# EAGLE design suit (EAGLE 6.5.0)
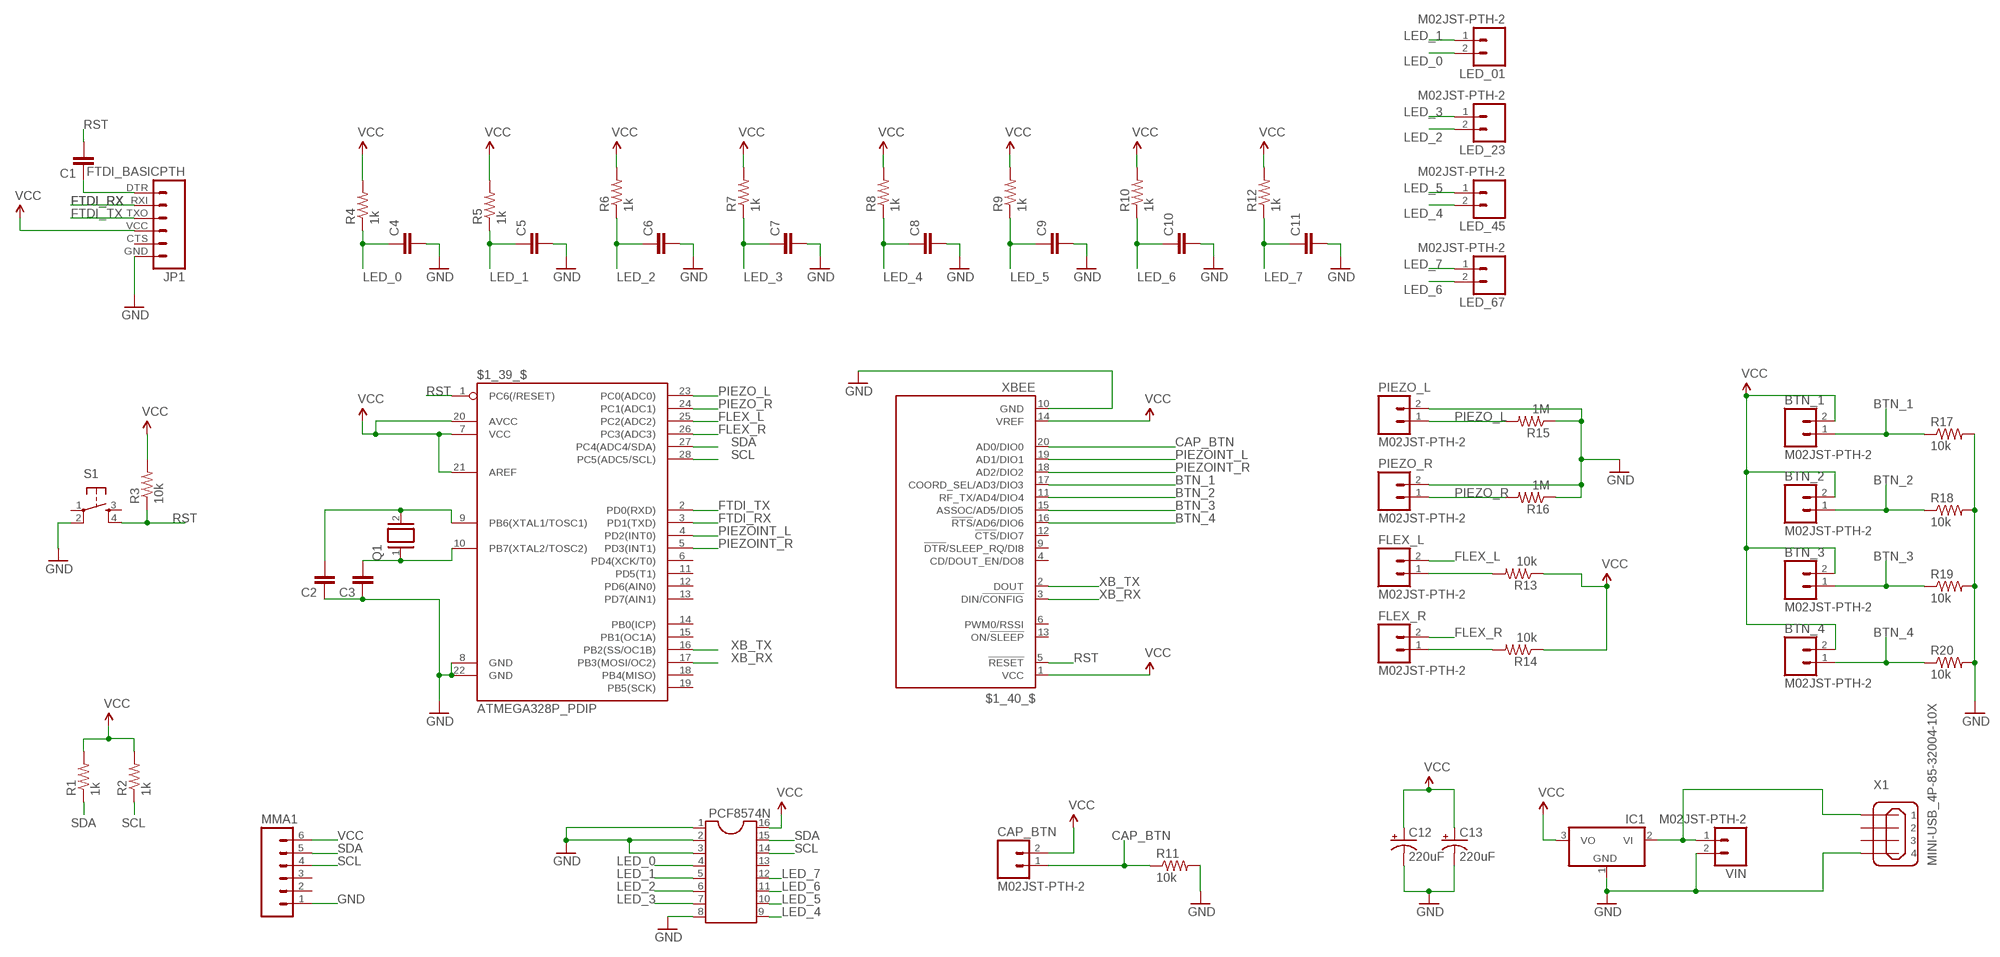
[diagram p0: schematic, sheet 1]

## Parts
$1_39_$  ATMEGA328P_PDIP  [DIL28-3]
$1_40_$  XBEE  [XBEE]
BTN_1  M02JST-PTH-2  [JST-2-PTH]
BTN_2  M02JST-PTH-2  [JST-2-PTH]
BTN_3  M02JST-PTH-2  [JST-2-PTH]
BTN_4  M02JST-PTH-2  [JST-2-PTH]
C1  CAPEZ  [CAP-PTH-SMALLEZ]
C2  CAPEZ  [CAP-PTH-SMALLEZ]
C3  CAPEZ  [CAP-PTH-SMALLEZ]
C4  CAPEZ  [CAP-PTH-SMALLEZ]
C5  CAPEZ  [CAP-PTH-SMALLEZ]
C6  CAPEZ  [CAP-PTH-SMALLEZ]
C7  CAPEZ  [CAP-PTH-SMALLEZ]
C8  CAPEZ  [CAP-PTH-SMALLEZ]
C9  CAPEZ  [CAP-PTH-SMALLEZ]
C10  CAPEZ  [CAP-PTH-SMALLEZ]
C11  CAPEZ  [CAP-PTH-SMALLEZ]
C12  220uF  CPOL-USB45181A  [B45181A]
C13  220uF  CPOL-USB45181A  [B45181A]
CAP_BTN  M02JST-PTH-2  [JST-2-PTH]
FLEX_L  M02JST-PTH-2  [JST-2-PTH]
FLEX_R  M02JST-PTH-2  [JST-2-PTH]
IC1  79L05Z  [TO92]
JP1  FTDI_BASICPTH  [FTDI_BASIC]
LED_01  M02JST-PTH-2  [JST-2-PTH]
LED_23  M02JST-PTH-2  [JST-2-PTH]
LED_45  M02JST-PTH-2  [JST-2-PTH]
LED_67  M02JST-PTH-2  [JST-2-PTH]
MMA1  M06FEMALE_LOCK  [1X06_FEMALE_LOCK.010]
PCF8574N  DIL16S  [SOCKET-16]
PIEZO_L  M02JST-PTH-2  [JST-2-PTH]
PIEZO_R  M02JST-PTH-2  [JST-2-PTH]
Q1  XTAL/S  [QS]
R1  1k  R-US_0207/10  [0207/10]
R2  1k  R-US_0207/10  [0207/10]
R3  10k  R-US_0207/10  [0207/10]
R4  1k  R-US_0207/10  [0207/10]
R5  1k  R-US_0207/10  [0207/10]
R6  1k  R-US_0207/10  [0207/10]
R7  1k  R-US_0207/10  [0207/10]
R8  1k  R-US_0207/10  [0207/10]
R9  1k  R-US_0207/10  [0207/10]
R10  1k  R-US_0207/10  [0207/10]
R11  10k  R-US_0207/10  [0207/10]
R12  1k  R-US_0207/10  [0207/10]
R13  10k  R-US_0207/10  [0207/10]
R14  10k  R-US_0207/10  [0207/10]
R15  1M  R-US_0207/10  [0207/10]
R16  1M  R-US_0207/10  [0207/10]
R17  10k  R-US_0207/10  [0207/10]
R18  10k  R-US_0207/10  [0207/10]
R19  10k  R-US_0207/10  [0207/10]
R20  10k  R-US_0207/10  [0207/10]
S1  TAC_SWITCHPTH  [TACTILE-PTH]
VIN  M02JST-PTH-2  [JST-2-PTH]
X1  MINI-USB_4P-85-32004-10X  [85-32004-10X]

## Nets
BTN_1: $1_40_$.17(COORD_SEL/AD3/DIO3) BTN_1.1 R17.1
BTN_2: $1_40_$.11(RF_TX/AD4/DIO4) BTN_2.1 R18.1
BTN_3: $1_40_$.15(ASSOC/AD5/DIO5) BTN_3.1 R19.1
BTN_4: $1_40_$.16(!RTS!/AD6/DIO6) BTN_4.1 R20.1
CAP_BTN: $1_40_$.20(AD0/DIO0) CAP_BTN.1 R11.1
FLEX_L: $1_39_$.25(PC2(ADC2)) FLEX_L.2
FLEX_R: $1_39_$.26(PC3(ADC3)) FLEX_R.2
FTDI_RX: $1_39_$.3(PD1(TXD)) JP1.RXI
FTDI_TX: $1_39_$.2(PD0(RXD)) JP1.TXO
GND: $1_39_$.8(GND) $1_39_$.22(GND) $1_40_$.10(GND) C2.1 C3.1 C4.2 C5.2 C6.2 C7.2 C8.2 C9.2 C10.2 C11.2 C12.- C13.- IC1.1(GND) JP1.GND MMA1.1 PCF8574N.1 PCF8574N.2 PCF8574N.3 PCF8574N.8 PIEZO_L.2 PIEZO_R.2 R11.2 R15.1 R16.1 R17.2 R18.2 R19.2 R20.2 S1.2 VIN.2 X1.4
LED_0: C4.1 LED_01.2 PCF8574N.4 R4.1
LED_1: C5.1 LED_01.1 PCF8574N.5 R5.1
LED_2: C6.1 LED_23.2 PCF8574N.6 R6.1
LED_3: C7.1 LED_23.1 PCF8574N.7 R7.1
LED_4: C8.1 LED_45.2 PCF8574N.9 R8.1
LED_5: C9.1 LED_45.1 PCF8574N.10 R9.1
LED_6: C10.1 LED_67.2 PCF8574N.11 R10.1
LED_7: C11.1 LED_67.1 PCF8574N.12 R12.1
N$1: FLEX_L.1 R13.2
N$2: FLEX_R.1 R14.2
N$4: C1.1 JP1.DTR
N$5: $1_39_$.10(PB7(XTAL2/TOSC2)) C3.2 Q1.1
N$6: $1_39_$.9(PB6(XTAL1/TOSC1)) C2.2 Q1.2
N$10: IC1.2(VI) VIN.1 X1.1
PIEZO_L: $1_39_$.23(PC0(ADC0)) PIEZO_L.1 R15.2
PIEZO_R: $1_39_$.24(PC1(ADC1)) PIEZO_R.1 R16.2
PIEZOINT_L: $1_39_$.4(PD2(INT0)) $1_40_$.19(AD1/DIO1)
PIEZOINT_R: $1_39_$.5(PD3(INT1)) $1_40_$.18(AD2/DIO2)
RST: $1_39_$.1(PC6(/RESET)) $1_40_$.5(!RESET) C1.2 R3.1 S1.4
SCL: $1_39_$.28(PC5(ADC5/SCL)) MMA1.4 PCF8574N.14 R2.1
SDA: $1_39_$.27(PC4(ADC4/SDA)) MMA1.5 PCF8574N.15 R1.1
VCC: $1_39_$.7(VCC) $1_39_$.20(AVCC) $1_39_$.21(AREF) $1_40_$.1(VCC) $1_40_$.14(VREF) BTN_1.2 BTN_2.2 BTN_3.2 BTN_4.2 C12.+ C13.+ CAP_BTN.2 IC1.3(VO) JP1.VCC MMA1.6 PCF8574N.16 R1.2 R2.2 R3.2 R4.2 R5.2 R6.2 R7.2 R8.2 R9.2 R10.2 R12.2 R13.1 R14.1
XB_RX: $1_39_$.17(PB3(MOSI/OC2)) $1_40_$.3(DIN/!CONFIG)
XB_TX: $1_39_$.16(PB2(SS/OC1B)) $1_40_$.2(DOUT)
Unconnected: $1_39_$.6(PD4(XCK/T0)) $1_39_$.11(PD5(T1)) $1_39_$.12(PD6(AIN0)) $1_39_$.13(PD7(AIN1)) $1_39_$.14(PB0(ICP)) $1_39_$.15(PB1(OC1A)) $1_39_$.18(PB4(MISO)) $1_39_$.19(PB5(SCK)) $1_40_$.4(CD/DOUT_EN/DO8) $1_40_$.6(PWM0/RSSI) $1_40_$.9(!DTR!/SLEEP_RQ/DI8) $1_40_$.12(!CTS!/DIO7) $1_40_$.13(ON/!SLEEP) JP1.CTS MMA1.2 MMA1.3 PCF8574N.13 S1.1 S1.3 X1.2 X1.3

## Library data of the parts
$1_39_$ = SparkFun-DigitalIC:ATMEGA328P_PDIP: uC used in the Arduino 32kb flash, 1k EEPROM, 2k SRAM This is the through-hole version of this chip.
$1_40_$ = maxstream:XBEE: XBee (TM) /XBee-PRO(TM) OEM RF Modules Source: MaxStream, Inc. xbee_productmanual.pdf; MPN: XBP24-Z7UIT-004; OC_FARNELL: 1751799; OC_NEWARK: 34R5507
BTN_1-BTN_4 CAP_BTN FLEX_L FLEX_R LED_01 LED_23 LED_45 LED_67 PIEZO_L PIEZO_R VIN = SparkFun-Connectors:M02: Standard 2-pin 0.1" header. Use with - straight break away headers ( PRT-00116) - right angle break away headers (PRT-00553) - swiss pins (PRT-00743) - machine pins (PRT-00117) - female headers (PRT-00115) Molex polarized connector foot print use with: PRT-08233 with associated crimp pins and housings. 2.54_SCREWTERM for use with PRT-10571. 3.5mm Screw Terminal footprints for PRT-08084 5mm Screw Terminal footprints for use with PRT-08433
C1-C11 = SparkFun-Passives:CAP: Capacitor Standard 0603 ceramic capacitor, and 0.1" leaded capacitor.
C12 C13 = rcl:CPOL-US: POLARIZED CAPACITOR, American symbol
IC1 = linear:79*: Negative VOLTAGE REGULATOR
JP1 = SparkFun-Connectors:FTDI_BASIC: FTDI Basic header with labels
MMA1 = SparkFun-Connectors:M06: Header 6 Standard 6-pin 0.1" header. Use with straight break away headers (SKU : PRT-00116), right angle break away headers (PRT-00553), swiss pins (PRT-00743), machine pins (PRT-00117), and female headers (PRT-00115). Molex polarized connector foot print use with SKU : PRT-08094 with associated crimp pins and housings. NOTES ON THE VARIANTS LOCK and LOCK_LONGPADS... This footprint was designed to help hold the alignment of a through-hole component (i.e. 6-pin header) while soldering it into place. You may notice that each hole has been shifted either up or down by 0.005 of an inch from it's more standard position (which is a perfectly straight line). This slight alteration caused the pins (the squares in the middle) to touch the edges of the holes. Because they are alternating, it causes a "brace" to hold the component in place. 0.005 has proven to be the perfect amount of "off-center" position when using our standard breakaway headers. Although looks a little odd when you look at the bare footprint, once you have a header in there, the alteration is very hard to notice. Also,if you push a header all the way into place, it is covered up entirely on the bottom side. This idea of altering the position of holes to aid alignment will be further integrated into the Sparkfun Library for other footprints. It can help hold any component with 3 or more connection pins.
PCF8574N = ic-package:DIL16: Dual In Line / Socket
Q1 = special:XTAL/S: CRYSTAL
R1-R20 = resistor:R-US_: RESISTOR, American symbol
S1 = SparkFun-Electromechanical:TAC_SWITCH: Momentary Switch Button commonly used for reset or general input. Spark Fun Electronics SKU : COM-00097 SMT- SWCH-08247
X1 = con-cypressindustries:MINI-USB_4P-: MINI USB 4 Pol. Source: www.cypressindustries.com; OC_FARNELL: unknown; OC_NEWARK: unknown

## Board
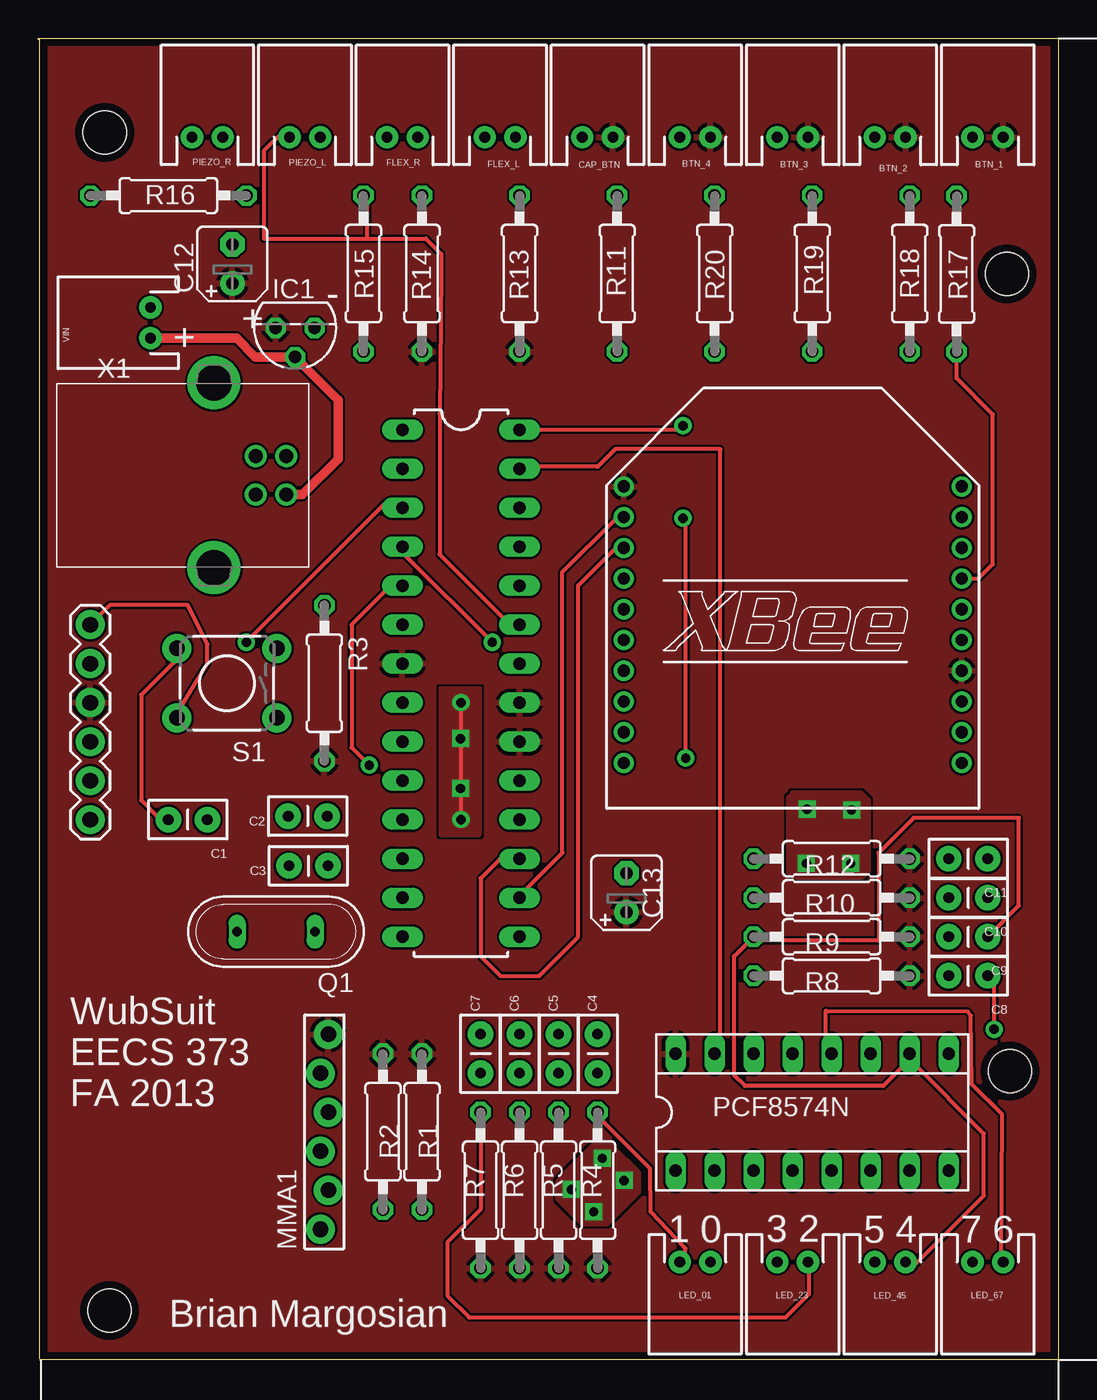
[diagram p1: board, top side]
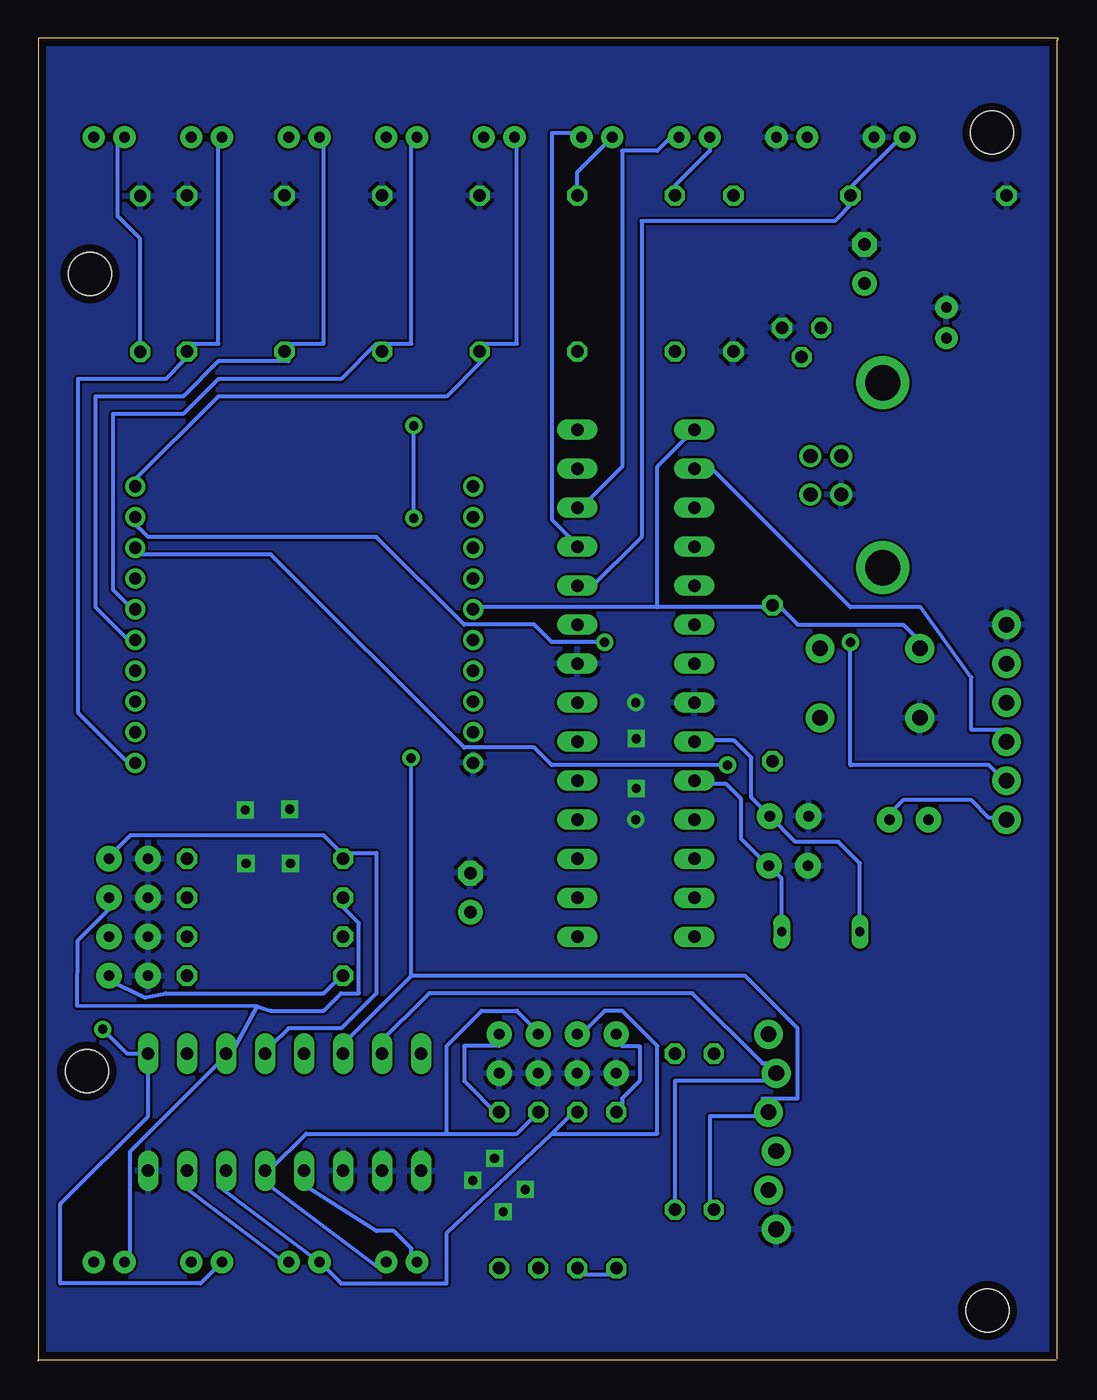
[diagram p2: board, bottom side, seen from below]

Size 66.4 x 86.13 mm. Coordinates in mm from the lower left corner, seen from the top.
Outline: 0.08,0.15 0.08,86.06 0,86.06 0,86.13 66.4,86.13 66.4,0.08
Outline: 66.4,0 66.4,0.08
Outline: 66.4,0.08 0.15,0.08
Copper layers (1+16): Top 0.0178mm / dielectric 12mil / Bottom 0.0178mm
Design rules "AVC-2Lyr": minimum track width 6mil, minimum drill 8mil, track to track 6mil, track to pad 6mil, pad to pad 6mil, via to via 6mil, smd to smd 6mil, copper to edge 20mil, drill to drill 16mil, minimum pad ring 10mil, minimum via ring 10mil, stop-mask expansion 3mil, vias tented up to drill 0mil, thermal gap 10mil
Holes 2.8 mm at 4.62,3.3 4.32,80.01 63.04,70.79 63.25,18.87

### Footprints (pad centres in the part's own frame; a part is rotated, then mirrored left to right if it is on the bottom)
DIL28-3 = drill 0.813 long: 1 -16.51,-3.81; 2 -13.97,-3.81; 3 -11.43,-3.81; 4 -8.89,-3.81; 5 -6.35,-3.81; 6 -3.81,-3.81; 7 -1.27,-3.81; 8 1.27,-3.81; 9 3.81,-3.81; 10 6.35,-3.81; 11 8.89,-3.81; 12 11.43,-3.81; 13 13.97,-3.81; 14 16.51,-3.81; 15 16.51,3.81; 16 13.97,3.81; 17 11.43,3.81; 18 8.89,3.81; 19 6.35,3.81; 20 3.81,3.81; 21 1.27,3.81; 22 -1.27,3.81; 23 -3.81,3.81; 24 -6.35,3.81; 25 -8.89,3.81; 26 -11.43,3.81; 27 -13.97,3.81; 28 -16.51,3.81
XBEE = drill 0.8 pad 1.27: 1 -11,9; 2 -11,7; 3 -11,5; 4 -11,3; 5 -11,1; 6 -11,-1; 7 -11,-3; 8 -11,-5; 9 -11,-7; 10 -11,-9; 11 11,-9; 12 11,-7; 13 11,-5; 14 11,-3; 15 11,-1; 16 11,1; 17 11,3; 18 11,5; 19 11,7; 20 11,9
JST-2-PTH = drill 0.7 pad 1.448: 1 -1,0; 2 1,0
CAP-PTH-SMALLEZ = drill 0.7 pad 1.651: 1 0,0; 2 2.54,0
B45181A = drill 0.813 pad 1.6: + -1.27,0 | drill 0.813 pad 1.6 octagon: - 1.27,0
TO92 = drill 0.813 octagon: 1 -1.27,0; 2 0,1.905; 3 1.27,0
FTDI_BASIC = drill 1.016 pad 1.88: CTS 10.16,0; DTR 0,0; GND 12.7,0; RXI 2.54,0; TXO 5.08,0; VCC 7.62,0
1X06_FEMALE_LOCK.010 = drill 1.016 pad 1.88: 1 0,0.254; 2 2.54,-0.254; 3 5.08,0.254; 4 7.62,-0.254; 5 10.16,0.254; 6 12.7,-0.254
SOCKET-16 = drill 0.813 long: 1 -8.89,-3.81; 2 -6.35,-3.81; 3 -3.81,-3.81; 4 -1.27,-3.81; 5 1.27,-3.81; 6 3.81,-3.81; 7 6.35,-3.81; 8 8.89,-3.81; 9 8.89,3.81; 10 6.35,3.81; 11 3.81,3.81; 12 1.27,3.81; 13 -1.27,3.81; 14 -3.81,3.81; 15 -6.35,3.81; 16 -8.89,3.81
QS = drill 0.61 long: 1 -2.54,0; 2 2.54,0
0207/10 = drill 0.813 octagon: 1 -5.08,0; 2 5.08,0
TACTILE-PTH = drill 1.016 pad 1.88: 1 -3.251,2.261; 2 3.251,2.261; 3 -3.251,-2.261; 4 3.251,-2.261
85-32004-10X = drill 0.92 pad 1.27: 1 4.71,-1.25; 2 4.71,1.25; 3 2.71,1.25; 4 2.71,-1.25 | drill 2.3 pad 3: M1 0,6.02; M2 0,-6.02

### Placement (x,y rotation side)
$1_39_$  27.51,44.15 270 top
$1_40_$  49.1,47.96 0 top
BTN_1  61.8,79.71 0 top
BTN_2  55.45,79.71 0 top
BTN_3  49.1,79.71 0 top
BTN_4  42.75,79.71 0 top
C1  11,35.26 180 top
C2  16.26,35.48 0 top
C3  16.31,32.26 0 top
C4  36.4,21.29 270 top
C5  33.86,21.29 270 top
C6  31.32,21.29 270 top
C7  28.78,21.29 270 top
C8  61.8,25.1 180 top
C9  61.8,27.64 180 top
C10  61.8,30.18 180 top
C11  61.8,32.72 180 top
C12  12.62,71.45 90 top
C13  38.28,30.51 90 top
CAP_BTN  36.4,79.71 0 top
FLEX_L  30.05,79.71 0 top
FLEX_R  23.7,79.71 0 top
IC1  16.71,67.28 180 top
JP1  3.38,35.26 90 top
LED_01  42.75,6.45 180 top
LED_23  49.1,6.45 180 top
LED_45  55.45,6.45 180 top
LED_67  61.8,6.45 180 top
MMA1  18.62,8.59 90 top
PCF8574N  50.37,16.21 0 top
PIEZO_L  17.35,79.71 0 top
PIEZO_R  11,79.71 0 top
Q1  15.47,27.97 180 top
R1  24.97,14.94 90 top
R2  22.43,14.94 90 top
R3  18.62,44.15 270 top
R4  36.4,11.13 270 top
R5  33.86,11.13 270 top
R6  31.32,11.13 270 top
R7  28.78,11.13 270 top
R8  51.64,25.1 0 top
R9  51.64,27.64 0 top
R10  51.64,30.18 0 top
R11  37.67,70.82 90 top
R12  51.64,32.72 0 top
R13  31.32,70.82 90 top
R14  24.97,70.82 90 top
R15  21.16,70.82 90 top
R16  8.46,75.9 0 top
R17  59.77,70.79 90 top
R18  56.72,70.82 90 top
R19  50.37,70.82 90 top
R20  44.02,70.82 90 top
S1  12.27,44.15 180 top
VIN  7.29,67.61 90 top
X1  11.43,57.68 0 top

### Tracks (layer width: path | path; a pad name or v marks a point on that pad's centre or on a via)
BTN_1
  Top 0.254: 60.73,79.64 BTN_1.1 | $1_40_$.17 61.19,50.96 62.13,51.89 62.13,61.65 59.77,64.01 R17.1
  Bottom 0.254: 60.4,79.96 BTN_1.1 61.24,79.26 61.24,74.55 59.77,73.08 R17.1
BTN_2
  Bottom 0.254: $1_40_$.11 60.4,38.81 63.83,42.24 63.83,63.96 58.12,63.96 56.97,65.1 R18.1 56.97,66.24 54.69,66.24 54.69,79.96 BTN_2.1
BTN_3
  Bottom 0.254: $1_40_$.15 60.4,46.81 62.69,49.1 62.69,62.81 56.97,62.81 54.69,65.1 50.11,65.1 R19.1 50.11,66.24 47.83,66.24 47.83,79.96 BTN_3.1
BTN_4
  Bottom 0.254: 44.4,66.24 46.69,63.96 54.69,63.96 56.97,61.67 61.54,61.67 61.54,50.24 60.4,49.1 $1_40_$.16 | 44.4,66.24 42.11,66.24 42.11,79.96 BTN_4.1 | 44.4,66.24 R20.1
CAP_BTN
  Bottom 0.254: $1_40_$.20 60.4,57.1 54.69,62.81 39.83,62.81 37.54,65.1 R11.1 37.54,66.24 35.26,66.24 35.26,79.96 CAP_BTN.1
FLEX_L
  Bottom 0.254: $1_39_$.25 31.83,53.67 32.97,54.81 32.97,79.96 30.68,79.96 FLEX_L.2
FLEX_R
  Bottom 0.254: $1_39_$.26 30.68,55.96 28.4,58.24 28.4,78.82 26.11,78.82 24.97,79.96 FLEX_R.2
FTDI_RX  (via drill 0.61)
  Top 0.254: v13.54,46.81 22.68,55.96 $1_39_$.3
  Bottom 0.254: v13.54,46.81 13.54,38.81 4.52,38.81 3.38,37.67 JP1.RXI
FTDI_TX
  Bottom 0.254: $1_39_$.2 22.68,58.24 13.54,49.1 8.97,49.1 5.66,44.53 5.66,41.1 3.38,41.1 JP1.TXO
GND  (via drill 0.6, 0.61)
  Top 0.254: S1.2 9.02,42.16 11,45.42 11,46.69 9.73,49.23 4.65,49.23 JP1.GND | v27.51,42.88 v27.51,35.26
  other vias: 34.7,11.18 36.14,9.73 38.13,11.76 36.7,13.21 52.88,32.41 49.99,32.41 50.04,35.94 52.93,35.89 27.48,40.54 27.48,37.29
  pour Bottom (rank 6): 0.25,85.83 66.14,85.85 66.01,0.15 0.38,0.38
  pour Top: 37.29,14.1 39.07,12.32 39.07,10.95 37.01,8.89 35.43,8.89 33.78,10.54 33.78,11.71 33.96,11.89 33.96,11.96 36.12,14.12
  pour Top: 49.07,37.06 53.52,37.06 54.05,36.53 54.05,31.9 53.62,31.47 49.17,31.47 48.82,31.83 48.82,36.73 49.1,37.01
  pour Top: 26.19,43.84 28.7,43.84 28.73,43.87 28.73,34.29 28.68,34.24 26.21,34.24 26.19,34.26 26.19,43.69
LED_0
  Top 0.254: R4.1 36.4,15.95 39.83,12.52 39.85,9.73 42.11,7.34 42.11,6.2 LED_01.2
  Bottom 0.254: R4.1 36.4,15.95 38.68,18.24 38.68,20.52 36.4,20.52 C4.1 | PCF8574N.4 48.97,11.38 44.4,8.48 43.26,8.48 42.11,7.34 42.11,6.2 LED_01.2
LED_1
  Bottom 0.254: R5.1 35.26,14.81 39.83,14.81 | 39.83,14.81 48.97,14.81 51.26,12.52 PCF8574N.5 51.26,11.38 44.4,6.2 LED_01.1 | 39.83,14.81 39.83,20.52 37.54,22.81 35.26,22.81 34.11,21.67 C5.1
LED_2
  Bottom 0.254: 47.83,6.2 54.69,11.38 PCF8574N.6 | 32.97,14.81 39.8,8.36 39.83,5.05 46.69,5.05 47.83,6.2 | 32.97,14.81 31.83,15.95 R6.1 | 47.83,6.2 LED_23.2 | 32.97,14.81 26.11,14.81 26.11,20.52 28.4,22.81 29.54,22.81 30.68,21.67 C6.1
LED_3
  Top 0.254: R7.1 28.78,9.88 26.62,7.72 26.62,4.27 28.04,2.84 48.64,2.84 50.17,4.37 50.17,6.38 LED_23.1
  Bottom 0.254: PCF8574N.7 56.97,11.38 50.11,6.2 LED_23.1 | R7.1 28.4,15.95 28.4,17.09 27.25,18.24 27.25,20.52 28.4,20.52 C7.1
LED_4  (via drill 0.6)
  Top 0.254: v62.2,21.62 62.2,24.69 C8.1
  Bottom 0.254: LED_45.2 54.69,6.2 55.83,5.05 64.97,5.05 64.97,10.24 59.26,15.95 PCF8574N.9 60.6,20.02 v62.2,21.62 | R8.1 46.69,25.1 47.83,23.95 58.12,23.95 59.46,23.67 61.8,24.79 C8.1
LED_5
  Top 0.254: LED_45.1 56.97,6.2 61.54,10.77 61.54,14.81 56.97,19.38 PCF8574N.10 56.72,19.63 54.99,17.91 46,17.91 45.29,18.62 45.29,26.37 R9.1 46.69,27.38 54.69,27.38 54.69,33.1 56.97,35.38 63.83,35.38 63.83,29.67 C9.1 61.54,27.38
LED_6
  Bottom 0.254: LED_67.2 60.4,6.2 60.4,13.67 54.69,19.38 PCF8574N.11 53.54,20.52 52.15,23.09 | 52.15,23.09 51.26,22.81 47.83,22.81 46.69,23.95 45.54,23.95 45.54,28.52 46.69,29.67 R10.1 | 52.15,23.09 63.88,23.14 63.83,27.38 61.54,29.67 C10.1
LED_7
  Top 0.254: LED_67.1 62.69,6.2 62.74,16.05 60.76,18.03 60.71,22.5 60.5,22.76 51.26,22.81 51.26,20.52 PCF8574N.12
  Bottom 0.254: 46.69,33.1 44.4,33.1 44.4,23.95 46.69,21.67 50.11,21.67 51.26,20.52 PCF8574N.12 | 46.69,33.1 47.83,34.24 60.4,34.24 61.54,33.1 C11.1 | 46.69,33.1 R12.1
N$1
  Bottom 0.254: R13.2 31.32,77.44 FLEX_L.1
N$2
  Bottom 0.254: R14.2 24.97,76.53 22.68,78.82 22.68,79.96 FLEX_R.1
N$4
  Bottom 0.254: C1.1 11.25,35.38 10.11,36.53 5.66,36.53 4.52,35.38 3.38,35.38 JP1.DTR
N$5
  Bottom 0.254: Q1.1 18.01,31.42 C3.2 18.9,32.26 20.65,34.01 20.65,36.6 21.62,37.57 23.47,37.57 $1_39_$.10
N$6
  Bottom 0.254: $1_39_$.9 23.62,40.41 21.11,40.41 19.99,39.29 19.99,36.7 18.8,35.51 C2.2 17.12,33.81 14.33,33.81 12.93,32.41 Q1.2
N$10
  Top 0.61: X1.1 17.19,56.43 19.51,58.75 19.51,62.59 IC1.2 14.12,65.38 12.9,66.6 7.31,66.6 VIN.1
PIEZO_L
  Top 0.254: 21.41,73.1 14.68,73.1 14.68,78.82 15.82,79.96 PIEZO_L.1 | 21.41,73.1 25.22,73.1 26.24,72.09 26.24,70.82 26.11,61.67 26.11,52.53 30.68,47.96 $1_39_$.23 | 21.41,73.1 21.41,75.39 R15.2
PIEZO_R
  Bottom 0.254: $1_39_$.24 30.56,50.24 27.13,53.67 27.13,74.24 14.55,74.24 13.41,75.39 R16.2 13.41,76.53 9.98,79.96 PIEZO_R.1
PIEZOINT_L  (via drill 0.61)
  Top 0.254: v29.54,46.81 23.83,52.53 $1_39_$.4
  Bottom 0.254: v29.54,46.81 32.97,46.81 34.11,47.96 38.68,47.96 44.4,53.67 59.26,53.67 60.4,54.81 $1_40_$.19
PIEZOINT_R  (via drill 0.61)
  Top 0.254: v21.54,38.81 20.4,39.95 20.4,47.96 22.68,50.24 $1_39_$.5
  Bottom 0.254: v21.54,38.81 32.97,38.81 34.11,39.95 38.68,39.95 51.26,52.53 60.4,52.53 $1_40_$.18
RST
  Top 0.254: C1.2 7.82,35.38 6.68,36.53 6.68,43.38 8.97,45.67 S1.4
  Bottom 0.254: 26.11,49.1 19.25,49.1 R3.1 18.11,49.1 16.97,47.96 10.11,47.96 8.97,46.81 S1.4 | 26.11,49.1 37.54,49.1 $1_40_$.5 | $1_39_$.1 26.11,58.24 26.11,49.1
SCL  (via drill 0.61)
  Top 0.254: v42.14,39.27 42.14,54.71 v41.96,54.89 | $1_39_$.28 41.71,60.66 v41.96,60.91
  Bottom 0.254: R2.1 22.68,10.24 22.68,15.95 19.25,15.95 MMA1.4 19.25,17.09 16.97,17.09 16.97,21.67 20.4,25.1 42.11,25.1 | 42.11,25.1 46.69,20.52 PCF8574N.14 | 42.11,25.1 42.11,39.22 | 42.11,39.22 42.09,39.24 | v41.96,54.89 v41.96,60.91 | 42.11,39.22 42.11,39.24 v42.14,39.27
SDA
  Top 0.254: $1_39_$.27 31.83,58.24 36.4,58.24 37.54,59.39 44.4,59.39 44.4,20.52 PCF8574N.15
  Bottom 0.254: R1.1 24.97,18.24 18.11,18.24 MMA1.5 18.11,19.38 19.25,19.38 23.83,23.95 40.97,23.95 44.4,20.52 PCF8574N.15
VCC
  Bottom 0.254: R7.2 28.27,5.66 31.7,5.66 R6.2
  pour Top (rank 6): 0.23,85.83 66.17,85.88 66.01,0.15 0.38,0.38
XB_RX
  Top 0.254: $1_39_$.17 30.05,32.72 28.78,31.45 28.78,26.37 30.05,25.1 32.59,25.1 35.13,27.64 35.13,50.5 37.67,53.04 38.02,53.04 $1_40_$.3
XB_TX
  Top 0.254: $1_40_$.2 37.54,54.81 34.11,51.38 34.11,33.1 31.83,30.81 $1_39_$.16

### Text on the board
tNames: - | + | + | WubSuit / EECS 373 / FA 2013 | 1 0 | 3 2 | 5 4 | 7 6 | Brian Margosian